# Altium schematic sheet st_v1.SchDoc
size 609 x 381 mm; SheetNumber: 1; SheetTotal: 1
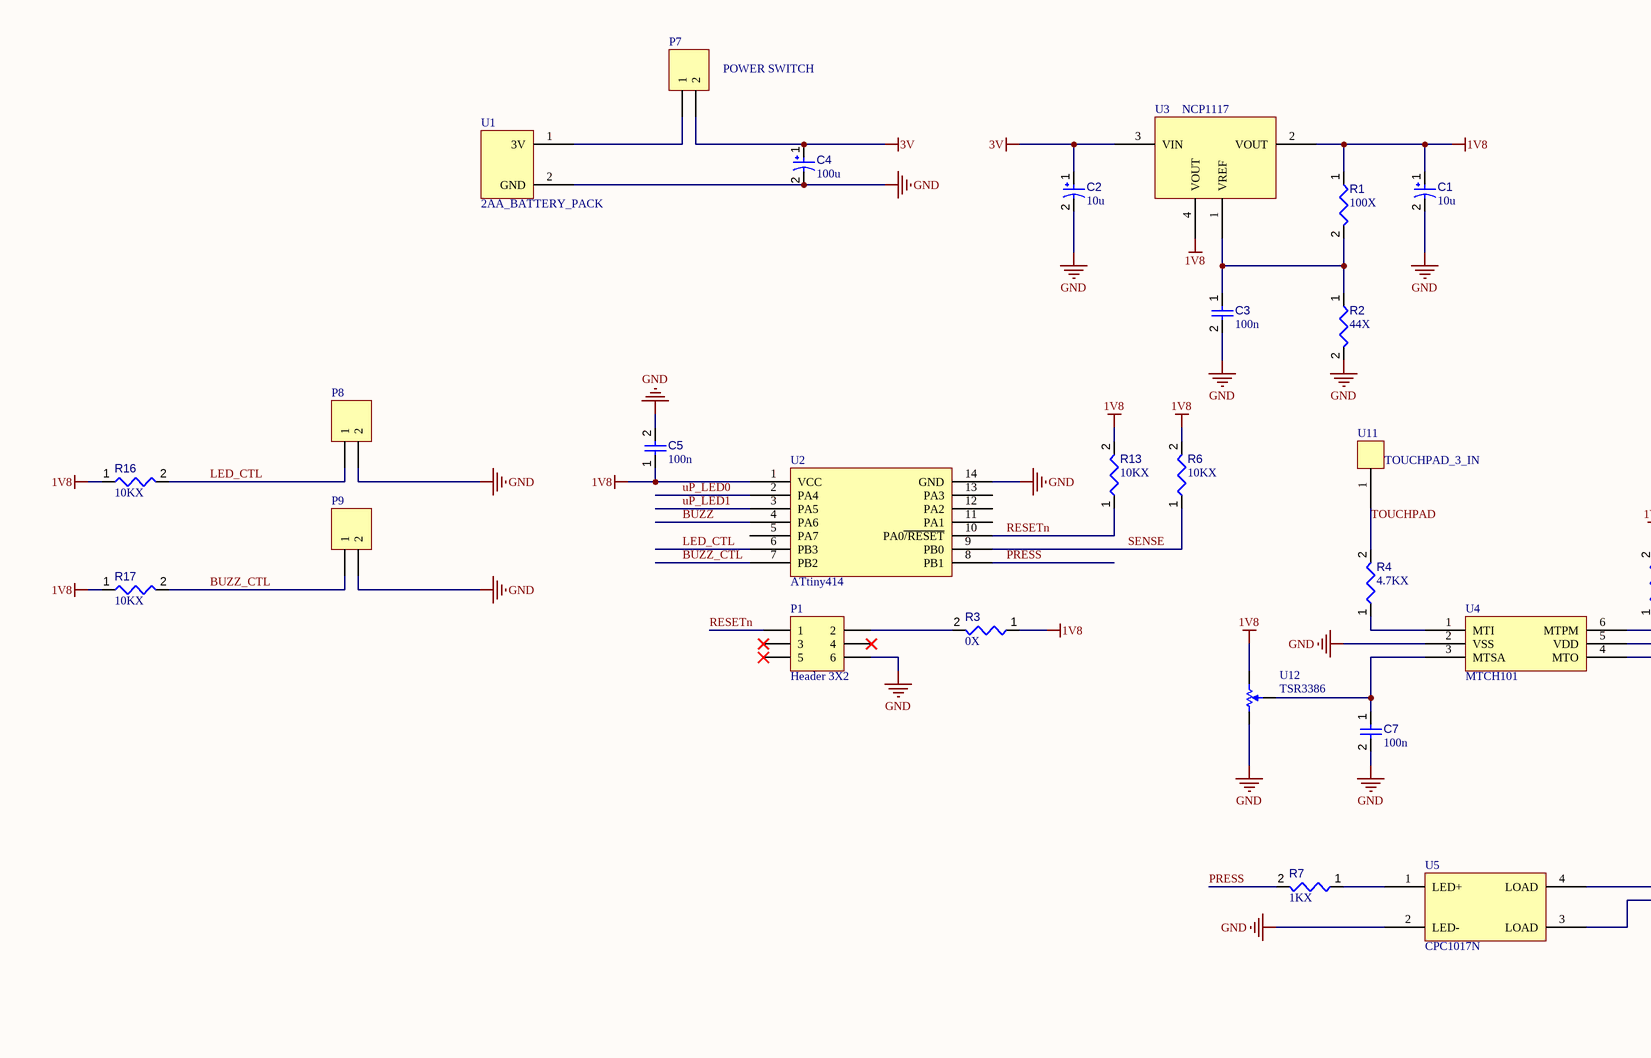
[diagram p0: st_v1.SchDoc, left]
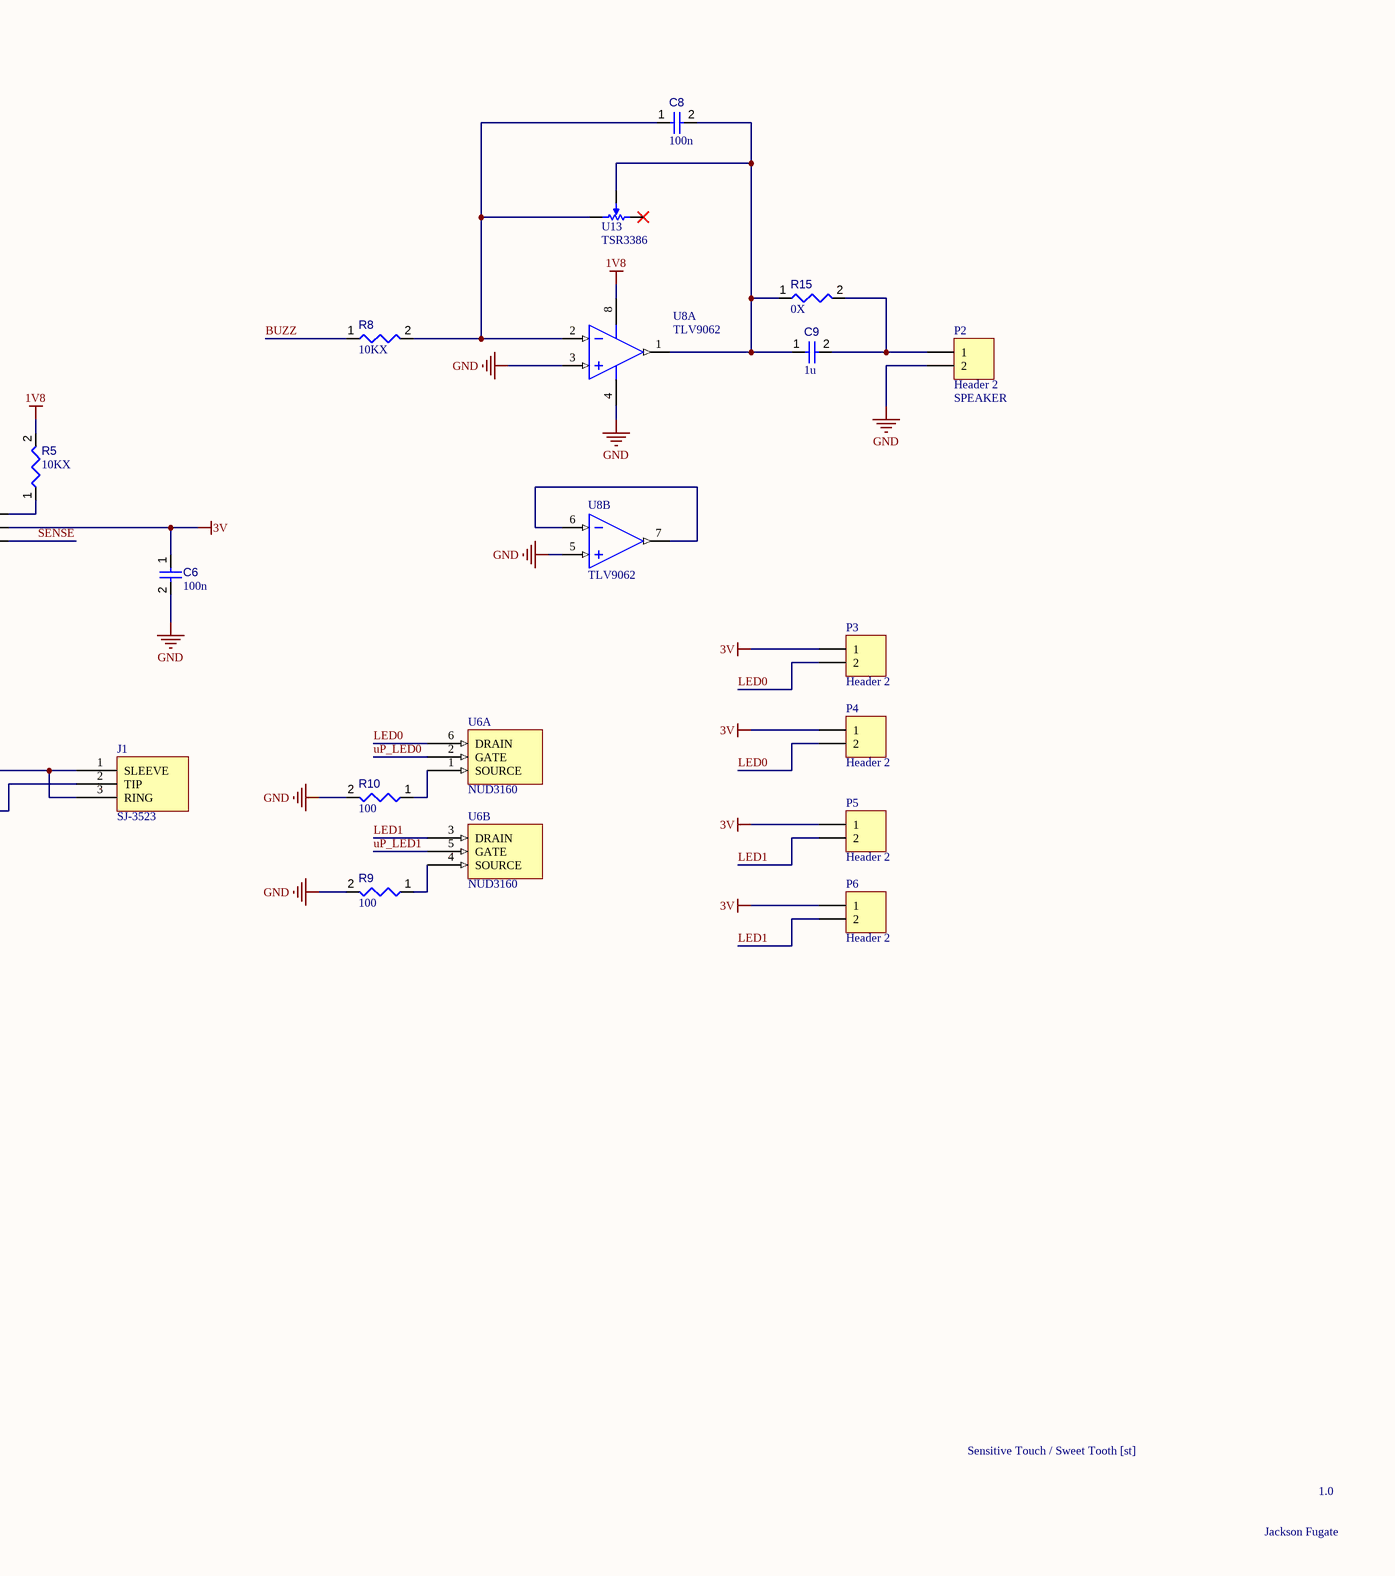
[diagram p1: st_v1.SchDoc, right]

## Parts
C1  value 10u  [CAPPR65-350-1150X800X1250]  (hidden comment: ECA-2AM470)
C2  value 10u  [CAPPR65-350-1150X800X1250]  (hidden comment: ECA-2AM470)
C3  value 100n  [CAPC2013X135X45NL10T25]  (hidden comment: Capacitor 10 uF +/- 10% 16 V 0805)
C4  value 100u  [CAPPR65-350-1150X800X1250]  (hidden comment: ECA-2AM470)
C5  value 100n  [CAPC2013X135X45NL10T25]  (hidden comment: Capacitor 10 uF +/- 10% 16 V 0805)
C6  value 100n  [CAPC2013X135X45NL10T25]  (hidden comment: Capacitor 10 uF +/- 10% 16 V 0805)
C7  value 100n  [CAPC2013X135X45NL10T25]  (hidden comment: Capacitor 10 uF +/- 10% 16 V 0805)
C8  value 100n  [CAPC2013X135X45NL10T25]  (hidden comment: Capacitor 10 uF +/- 10% 16 V 0805)
C9  value 1u  [CAPC2013X135X45NL10T25]  (hidden comment: Capacitor 10 uF +/- 10% 16 V 0805)
J1  SJ-3523  [SJ-352X]
P1  Header 3X2  [HDR2X3]
P2  Header 2  [HDR1X2]
P3  Header 2  [HDR1X2]
P4  Header 2  [HDR1X2]
P5  Header 2  [HDR1X2]
P6  Header 2  [HDR1X2]
P7  POWER SWITCH  [HDR1X2]
P8  POWER SWITCH  [HDR1X2]  (value not drawn)
P9  POWER SWITCH  [HDR1X2]  (value not drawn)
R1  value 100X  [RESC0805(2012)_L]  (hidden comment: 1KR5J)
R2  value 44X  [RESC0805(2012)_L]  (hidden comment: 1KR5J)
R3  value 0X  [RESC0805(2012)_L]  (hidden comment: 1KR5J)
R4  value 4.7KX  [RESC0805(2012)_L]  (hidden comment: 1KR5J)
R5  value 10KX  [RESC0805(2012)_L]  (hidden comment: 1KR5J)
R6  value 10KX  [RESC0805(2012)_L]  (hidden comment: 1KR5J)
R7  value 1KX  [RESC0805(2012)_L]  (hidden comment: 1KR5J)
R8  value 10KX  [RESC0805(2012)_L]  (hidden comment: 1KR5J)
R9  value 100  [RESC0805(2012)_L]  (hidden comment: 1KR5J)
R10  value 100  [RESC0805(2012)_L]  (hidden comment: 1KR5J)
R13  value 10KX  [RESC0805(2012)_L]  (hidden comment: 1KR5J)
R15  value 0X  [RESC0805(2012)_L]  (hidden comment: 1KR5J)
R16  value 10KX  [RESC0805(2012)_L]  (hidden comment: 1KR5J)
R17  value 10KX  [RESC0805(2012)_L]  (hidden comment: 1KR5J)
U1  2AA_BATTERY_PACK  [2AA_BATTERY_PACK]
U2  ATtiny414  [SOIC-14]
U3  NCP1117  [SOT-223]
U4  MTCH101  [SOT-23-6]
U5  CPC1017N  [CPC1017N]
U6  NUD3160  [SC-74]  (parts A,B of 2)
U8  TLV9062  [SOIC-8]  (parts A,B of 2)
U11  TOUCHPAD_3_IN  [TOUCHPAD_3_IN]
U12  TSR3386  [TSR3386]
U13  TSR3386  [TSR3386]

## Nets
1V8: C1.1 C5.1 R1.1 R3.1 R5.2 R6.2 R13.2 R16.1 R17.1 U2.1(VCC) U3.2(VOUT) U3.4(VOUT) U8.8(V+) U12.1(B)
3V: C2.1 C4.1 C6.1 P3.1 P4.1 P5.1 P6.1 P7.2 U3.3(VIN) U4.5(VDD)
GND: C1.2 C2.2 C3.2 C4.2 C5.2 C6.2 C7.2 P1.6 P2.2 P8.2 P9.2 R2.2 R9.2 R10.2 U1.2(GND) U2.14(GND) U4.2(VSS) U5.2(LED-) U8.3(+IN) U8.4(V-) U8.5(+IN) U12.3(A)
BUZZ: R8.1 U2.4(PA6)
BUZZ_CTL: P9.1 R17.2 U2.7(PB2)
LED0: P3.2 P4.2 U6.6(DRAIN)
LED1: P5.2 P6.2 U6.3(DRAIN)
LED_CTL: P8.1 R16.2 U2.6(PB3)
PRESS: R7.2 U2.8(PB1)
RESETn: P1.1 R13.1 U2.10(PA0~{/RESET})
SENSE: R6.1 U2.9(PB0) U4.4(MTO)
TOUCHPAD: R4.2 U11.1
uP_LED0: U2.2(PA4) U6.2(GATE)
uP_LED1: U2.3(PA5) U6.5(GATE)
NetC3_1: C3.1 R1.2 R2.1 U3.1(VREF)
NetC7_1: C7.1 U4.3(MTSA) U12.2(TAP)
NetC8_1: C8.1 R8.2 U8.2(-IN) U13.1(B)
NetC8_2: C8.2 C9.1 R15.1 U8.1(OUT) U13.2(TAP)
NetC9_2: C9.2 P2.1 R15.2
NetJ1_1: J1.1(SLEEVE) J1.3(RING) U5.4(LOAD)
NetJ1_2: J1.2(TIP) U5.3(LOAD)
NetP1_2: P1.2 R3.2
NetP7_1: P7.1 U1.1(3V)
NetR4_1: R4.1 U4.1(MTI)
NetR5_1: R5.1 U4.6(MTPM)
NetR7_1: R7.1 U5.1(LED+)
NetR9_1: R9.1 U6.4(SOURCE)
NetR10_1: R10.1 U6.1(SOURCE)
NetU8_6: U8.6(-IN) U8.7(OUT)

Not connected (* = marked no-connect by the designer): P1 3* 4* 5*; U2 5(PA7) 11(PA1) 12(PA2) 13(PA3); U13 3(A)*

## Notes on the sheet
- (near P2) SPEAKER
- Sensitive Touch / Sweet Tooth [st]
- 1.0
- Jackson Fugate

## Library data of the parts
C1 C2 C4 = CMP-001-00036-6: Aluminum Electrolytic Capacitor, 47 uF, +/- 20%, 100 V, -40 to 85 degC, 2-Pin THD, RoHS, Bulk; Manufacturer: Panasonic; Ripple Current (AC): 180mA; Voltage Rating: 100V; Package Reference: CAPPR65-350-1150X800X1250; Packaging: Bulk; Ripple Current: 180mA; Pins: 2; Capacitor Type: Electrolytic; RoHS Compliant: True; Tolerance: 20%; Datasheet URL: http://industrial.panasonic.com/cdbs/www-data/pdf/RDF0000/ABA0000C1047.pdf; Max Operating Temperature: 85°C; Package Description: 2-Pin Radial Lead, Dia 8 mm, Height 12.5 mm; Diameter: 8mm; Lead Pitch: 3.5mm; Mounting Technology: TH; Datasheet Version: Mar-16; Manufacturer URL: http://www.panasonic.com/; Case/Package: Radial; Package Quantity: 200; Min Operating Temperature: -40°C
C3 C5-C9 = CMP-001-00015-5: Chip Capacitor, 10 uF, +/- 10%, 16 V, 0805 (2012 Metric); Voltage Rating: 16V; Capacitor Type: Ceramic; Tolerance: 10%; Max Operating Temperature: 85°C; Pins: 2; Min Operating Temperature: -55°C; Mounting Technology: SM; RoHS Compliant: True; Case/Package: 0805
P1 = CMP-002-00165-1: Header, 3-Pin, Dual row; Signal Integrity: Connector; Publisher: Altium Limited; Component Type: Standard; Pins: 6; Design Item ID: Header 3X2; LatestRevisionDate: 17-Jul-2002; Source: Miscellaneous Connectors.SchLib; LatestRevisionNote: Re-released for DXP Platform.
P2-P9 = CMP-002-00141-1: Header, 2-Pin; Signal Integrity: Connector; LatestRevisionDate: 17-Jul-2002; Component Type: Standard; Pins: 2; Publisher: Altium Limited; LatestRevisionNote: Re-released for DXP Platform.; Source: Miscellaneous Connectors.SchLib; Design Item ID: Header 2
R1-R10 R13 R15-R17 = CMP-009-00076-1: 1K 0.125W 5% 0805 (2012 Metric)  SMD; Mounting Technology: SMT; Power: 0.125W; Pins: 2; Case/Package: 0805; Tolerance: 5%